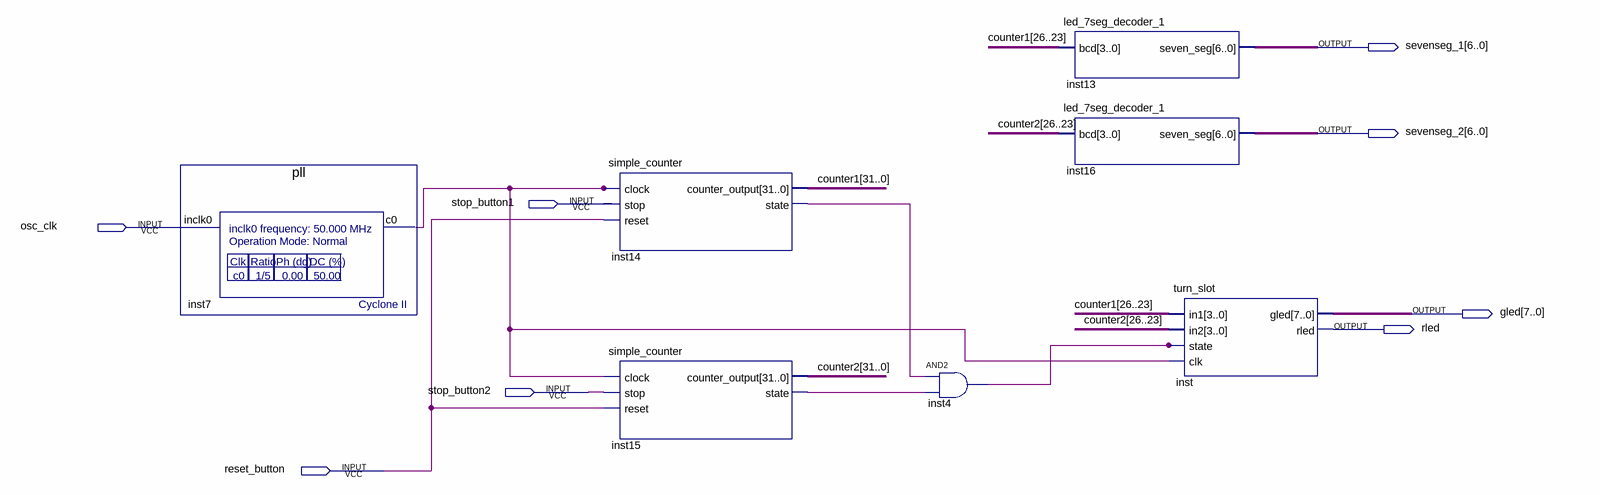
[diagram p0: schematic sheet]
// Quartus schematic AkiraKadai_top.bdf as structural Verilog: 7 symbols, 8 pins
module AkiraKadai_top (
  input  stop_button1,
  input  osc_clk,
  input  stop_button2,
  input  reset_button,
  output [6:0] sevenseg_1,
  output [6:0] sevenseg_2,
  output [7:0] gled,
  output rled
);

  wire inst4_out, inst7_c0, inst14_state, inst15_state;
  wire [31:0] counter1, counter2;

  pll inst7 (.inclk0(osc_clk), .c0(inst7_c0));
  simple_counter inst14 (
    .clock(inst7_c0), .stop(stop_button1), .reset(reset_button), .counter_output(counter1),
    .state(inst14_state));
  simple_counter inst15 (
    .clock(inst7_c0), .stop(stop_button2), .reset(reset_button), .counter_output(counter2),
    .state(inst15_state));
  and inst4 (inst4_out, inst14_state, inst15_state);
  led_7seg_decoder_1 inst13 (.bcd(counter1[26:23]), .seven_seg(sevenseg_1));
  led_7seg_decoder_1 inst16 (.bcd(counter2[26:23]), .seven_seg(sevenseg_2));
  turn_slot inst (
    .in1(counter1[26:23]), .in2(counter2[26:23]), .state(inst4_out), .clk(inst7_c0), .gled(gled), .rled(rled));
endmodule
